# Altium schematic sheet Main.SchDoc: Breakout 20pin
size A3; Organization: INTERCREATE; Address1: 2415 3RD ST. SUITE #232; Address2: SAN FRANCISCO CA 94107; SheetNumber: 1; SheetTotal: 1; ProjectName: KAGWERKS COMMAND CENTER
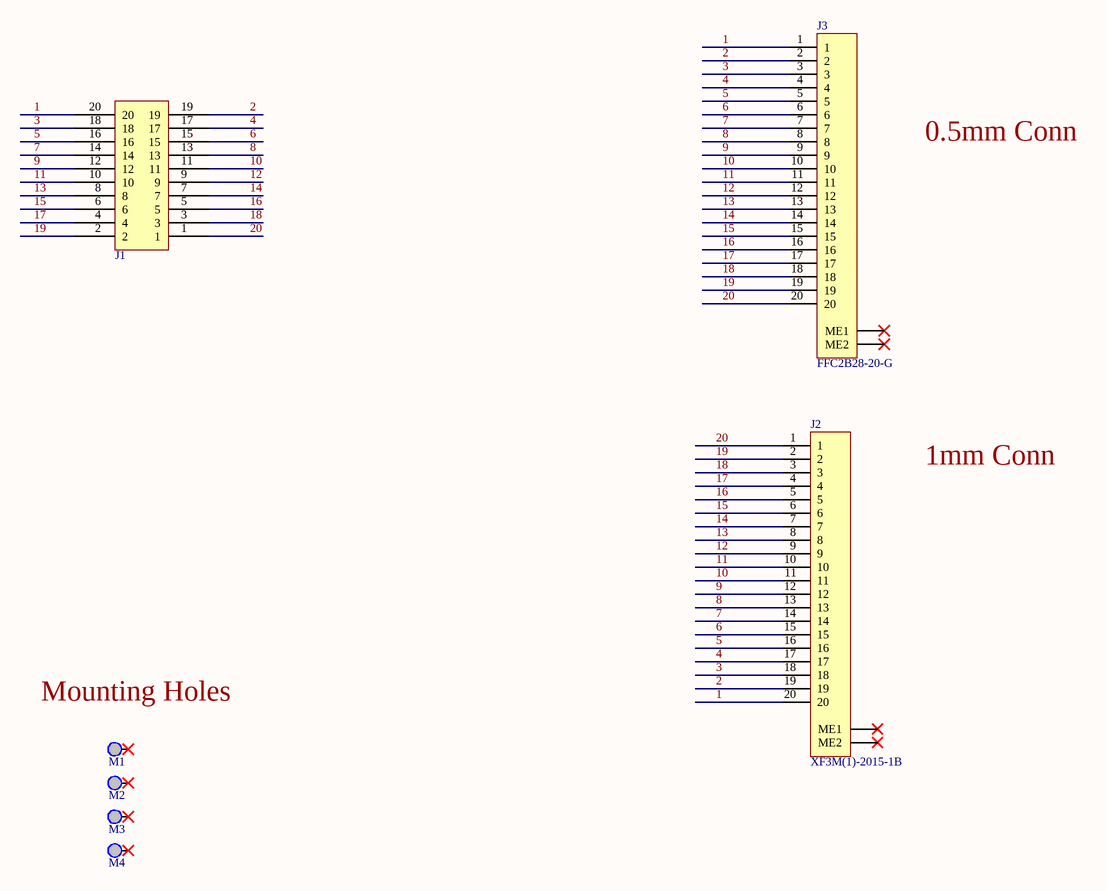
[diagram p0: Main.SchDoc]

## Parts
J1  SBH11-PBPC-D10-ST-BK  [HDR-V-2x10-KEYED]  (value not drawn)
J2  XF3M(1)-2015-1B  [CONN-FFC-H-20P-1MM]
J3  FFC2B28-20-G  [CONN-FFC-H-20P-0.5MM]
M1  MTG_HOLE  [MH_P_2.5MM]  (value not drawn)  (no BOM)
M2  MTG_HOLE  [MH_P_2.5MM]  (value not drawn)  (no BOM)
M3  MTG_HOLE  [MH_P_2.5MM]  (value not drawn)  (no BOM)
M4  MTG_HOLE  [MH_P_2.5MM]  (value not drawn)  (no BOM)

## Nets
1: J1.20 J2.20 J3.1
2: J1.19 J2.19 J3.2
3: J1.18 J2.18 J3.3
4: J1.17 J2.17 J3.4
5: J1.16 J2.16 J3.5
6: J1.15 J2.15 J3.6
7: J1.14 J2.14 J3.7
8: J1.13 J2.13 J3.8
9: J1.12 J2.12 J3.9
10: J1.11 J2.11 J3.10
11: J1.10 J2.10 J3.11
12: J1.9 J2.9 J3.12
13: J1.8 J2.8 J3.13
14: J1.7 J2.7 J3.14
15: J1.6 J2.6 J3.15
16: J1.5 J2.5 J3.16
17: J1.4 J2.4 J3.17
18: J1.3 J2.3 J3.18
19: J1.2 J2.2 J3.19
20: J1.1 J2.1 J3.20

Not connected (* = marked no-connect by the designer): J2 ME1* ME2*; J3 ME1* ME2*; M1 1*; M2 1*; M3 1*; M4 1*

## Notes on the sheet
- 0.5mm Conn
- 1mm Conn
- (near M1) Mounting Holes
- Title
- Size:
- Date:
- A3
- Number:
- Time:
- Revision:
- Sheet
- of
- File:

## Library data of the parts
J1 = HDR-V-2x10-M: CONN HEADER VERT 20POS 2.54MM; Manufacturer 1: Sullins; Number of Positions: 20; Connector Type: Male Pin; Pitch: 0.1inch; Supplier 1: Digi-Key; Manufacturer Part Number 1: SBH11-PBPC-D10-ST-BK; Stock 1: 23438; Pricing 1: 1=0.54000, 10=0.51000, 100=0.39120, 500=0.34020, 1000=0.28067, 5000=0.24665, 10000=0.24570 (USD); RoHS: Yes; Mount: Through Hole; Color: Black; Contact Plating: Gold; Package Quantity: 1; Number of Rows: 2; Packaging: Tray; Termination: Solder; Row Spacing: 0.1inch; Lead Free: Lead Free; ComponentLink1URL: https://datasheet.ciiva.com/730/sbh11-pbpc-dxx-st-xx-730919.pdf?src-supplier=Digi-Key; ComponentLink1Description: https://datasheet.ciiva.com/730/sbh11-pbpc-dxx-st-xx-730919.pdf?src-supplier=Digi-Key; Supplier Part Number 1: S9172-ND
J2 = CONN-FFC-H-20P-1MM: 1.0-mm Pitch, Dual Contact ; For FPC/FFC, 20 Contacts, RoHS; Manufacturer 1: Omron; Actuator Material: Polymer,Liquid Crystal Polymer; Actuator Color: Black; Number of Positions: 20; Voltage Rating: 50V; Pitch: 1mm; Supplier: Newark; Supplier Part Number: 40AJ2875; Manufacturer Part Number 1: XF3M(1)-2015-1B; RoHS: Yes; Category: FFC / FPC; Stock: 4134; Pricing: 1500=1.26 (USD); Mounting Technology: Surface Mount; Contact Material: Copper Alloy; Contact Plating: Gold; Housing Material: Polymer; Housing Color: Natural; Min Operating Temperature: -30°C; Max Operating Temperature: 85°C; Number of Rows: 1; Packaging: Cut Tape; Termination: Solder; Orientation: Right Angle; Series: XF3M; Mating Cycles: 20; Flammability Rating: UL94 V-0; RoHS Compliant: Yes; ComponentLink1URL: https://datasheet.ciiva.com/48563/en-xf3m-48563770.pdf?src-supplier=Avnet; ComponentLink1Description: https://datasheet.ciiva.com/48563/en-xf3m-48563770.pdf?src-supplier=Avnet
J3 = CONN-FFC-H-20P-0.5MM: 20W, 0.5MM Ffc Con, R/a, Dual Cont,; Manufacturer 1: Global Connector Technology; Supplier: Newark; Supplier Part Number: 90AJ6015; Manufacturer Part Number 1: FFC2B28-20-G; RoHS: No; Category: Connectors; Stock: 4000; Pricing: 1=0.812, 250=0.625, 500=0.563, 1000=0.511, 4000=0.511, 5000=0.468 (USD)
M1-M4 = MTG_HOLE: MTG HOLE PLATED VARIOUS SIZES